# EAGLE design MainBoard (EAGLE 7.5.0)
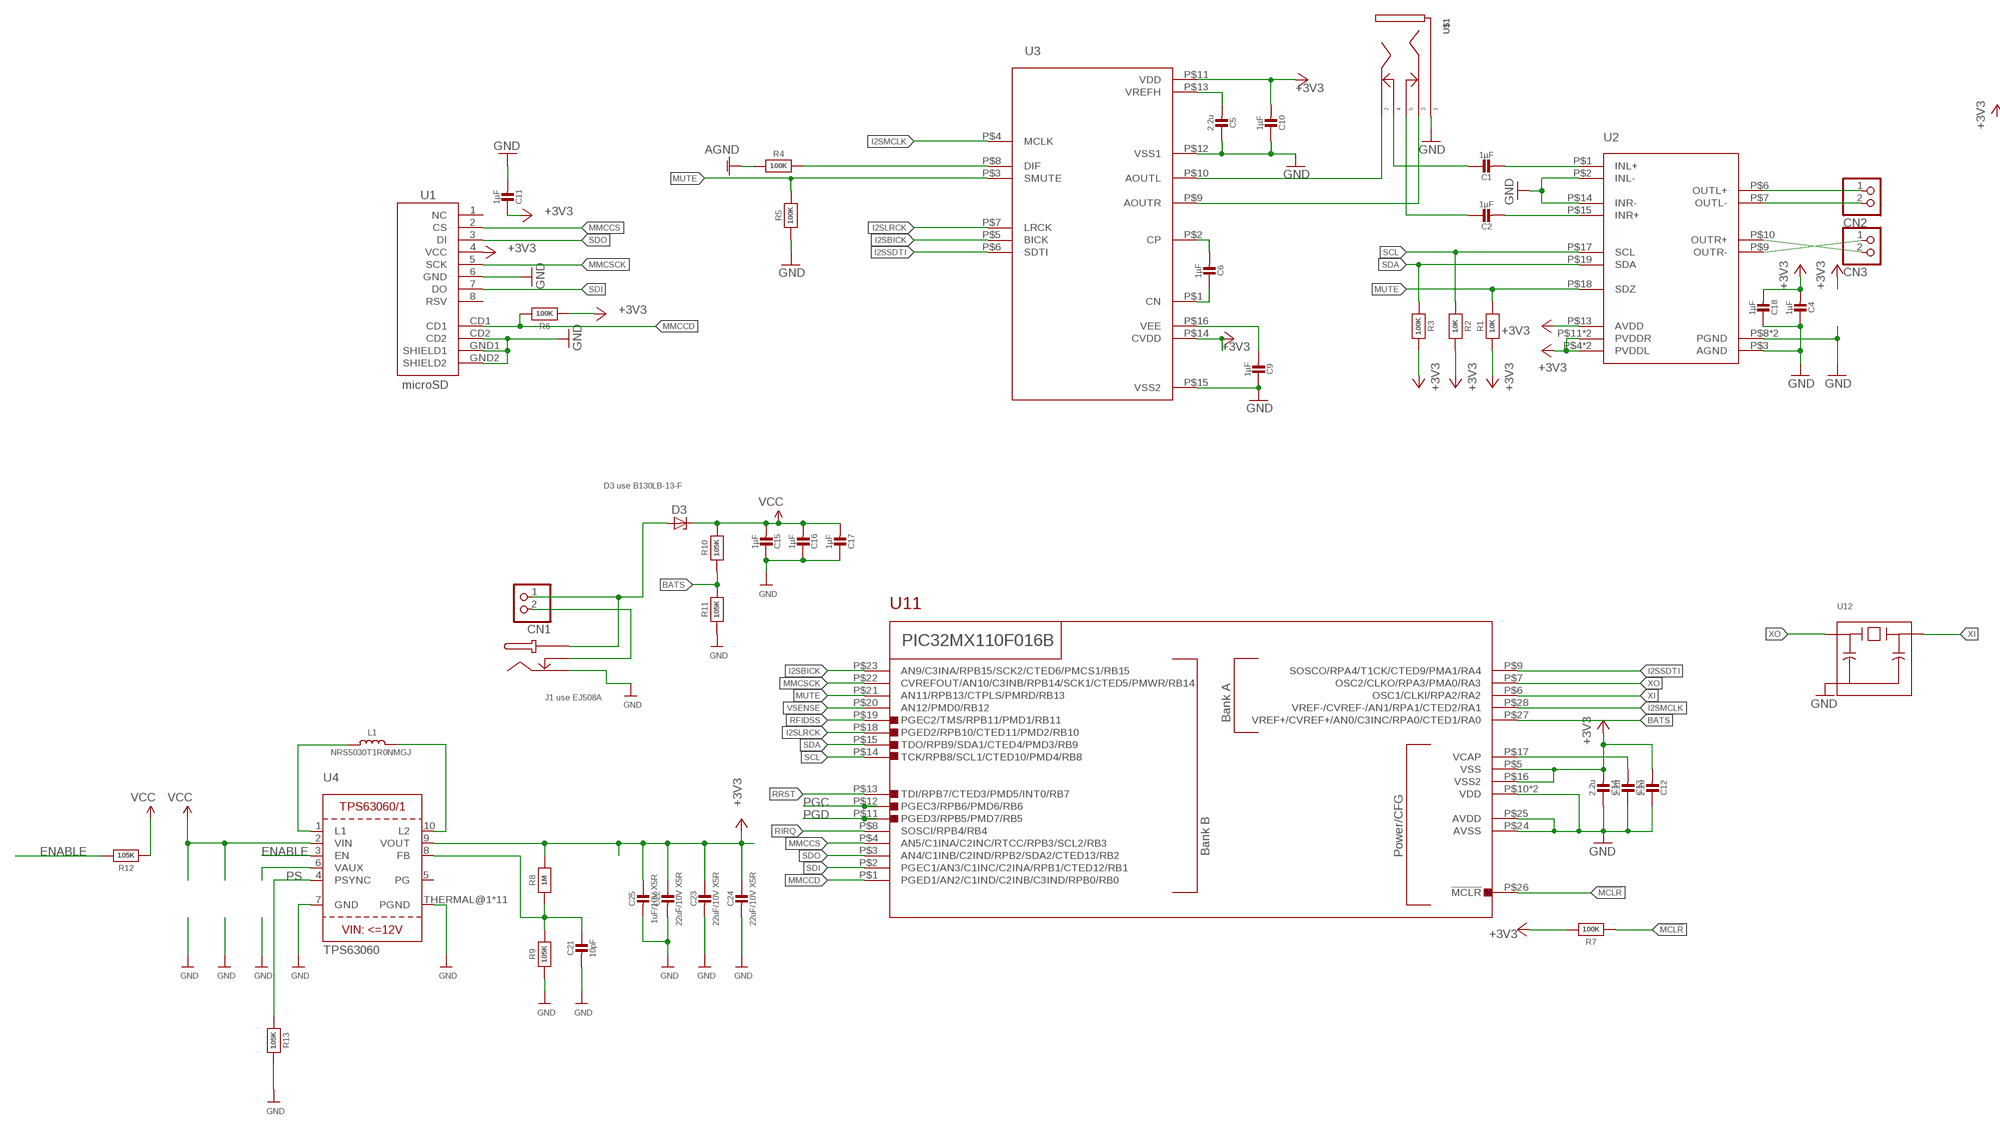
[diagram p0: schematic, sheet 1, part 1 of 2]
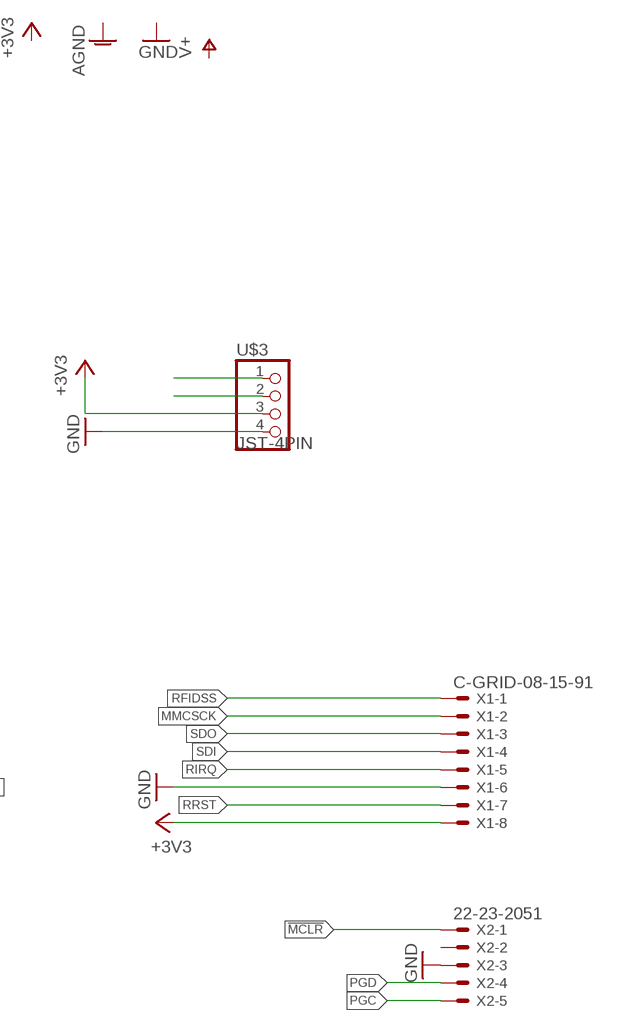
[diagram p1: schematic, sheet 1, part 2 of 2]

## Parts
C1  1µF  CAP_CERAMIC0603_NO  [0603-NO]
C2  1µF  CAP_CERAMIC0603_NO  [0603-NO]
C4  1µF  CAP_CERAMIC0805-NOOUTLINE  [0805-NO]
C5  2.2u  CAP_CERAMIC0603_NO  [0603-NO]
C6  1µF  CAP_CERAMIC0603_NO  [0603-NO]
C9  1µF  CAP_CERAMIC0603_NO  [0603-NO]
C10  1µF  CAP_CERAMIC0603_NO  [0603-NO]
C11  1µF  CAP_CERAMIC0603_NO  [0603-NO]
C12  2.2u  CAP_CERAMIC0603_NO  [0603-NO]
C13  2.2u  CAP_CERAMIC0603_NO  [0603-NO]
C14  2.2u  CAP_CERAMIC0603_NO  [0603-NO]
C15  1µF  CAP_CERAMIC0805-NOOUTLINE  [0805-NO]
C16  1µF  CAP_CERAMIC0805-NOOUTLINE  [0805-NO]
C17  1µF  CAP_CERAMIC0805-NOOUTLINE  [0805-NO]
C18  1µF  CAP_CERAMIC0805-NOOUTLINE  [0805-NO]
C21  10pF  CAP_CERAMIC0603_NO  [0603-NO]
C22  22uF/10V X5R  CAP_CERAMIC0805-NOOUTLINE  [0805-NO]
C23  22uF/10V X5R  CAP_CERAMIC0805-NOOUTLINE  [0805-NO]
C24  22uF/10V X5R  CAP_CERAMIC0805-NOOUTLINE  [0805-NO]
C25  1uF/10V X5R  CAP_CERAMIC0805-NOOUTLINE  [0805-NO]
CN1  JST_2PIN-SMT-RA  [JST-PH-2-SMT-RA]
CN2  JST_2PIN-SMT-RA  [JST-PH-2-SMT-RA]
CN3  JST_2PIN-SMT-RA  [JST-PH-2-SMT-RA]
D3  ZENER-DIODESOD80C  [SOD80C]
L1  NRS5030T1R0NMGJ  INDUCTORTDK_VLC5045  [INDUCTOR_5X5MM_TDK_VLC5045]
R1  10K  RESISTOR_0603_NOOUT  [0603-NO]
R2  10K  RESISTOR_0603_NOOUT  [0603-NO]
R3  100K  RESISTOR_0603_NOOUT  [0603-NO]
R4  100K  RESISTOR_0603_NOOUT  [0603-NO]
R5  100K  RESISTOR_0603_NOOUT  [0603-NO]
R6  100K  RESISTOR_0603_NOOUT  [0603-NO]
R7  100K  RESISTOR_0603_NOOUT  [0603-NO]
R8  1M  RESISTOR_0603_NOOUT  [0603-NO]
R9  105K  RESISTOR_0603_NOOUT  [0603-NO]
R10  105K  RESISTOR_0603_NOOUT  [0603-NO]
R11  105K  RESISTOR_0603_NOOUT  [0603-NO]
R12  105K  RESISTOR_0603_NOOUT  [0603-NO]
R13  105K  RESISTOR_0603_NOOUT  [0603-NO]
U1  microSD  USD-SOCKETSMD  [MICRO-SD-SOCKET-PP]
U2  TPA2016  [S-PWQFN-N20]
U3  AK4430ET  [16TSSOP]
U4  TPS63060  VREG_TPS63060/1  [PWSON-N10]
U11  PIC32MX110QFN  [28-QFN]
U12  CSTCE  [CSTCE]
U$1  3,5MMPHONO  [SJ1-351X]
U$2  PJ-002AH  [PJ-002AH-SMT]
U$3  JST-4PIN  [JST-PH-4-SMT-RA]
X1  C-GRID-08-15-91  [15-91-08]
X2  22-23-2051  [22-23-2051]

## Nets
!MCLR: R7.1 U11.P$26(!MCLR) X2.1
+3V3: C4.2 C10.2 C11.1 C12.2 C14.2 C18.2 C22.1 C23.1 C24.1 C25.1 R1.1 R2.2 R3.2 R6.1 R7.2 R8.2 U1.4(VCC) U2.P$4(PVDDL) U2.P$5(PVDDL) U2.P$11(PVDDR) U2.P$12(PVDDR) U2.P$13(AVDD) U3.P$11(VDD) U3.P$14(CVDD) U4.9(VOUT) U11.P$5(VSS) U11.P$16(VSS2) U$3.3 X1.8
AGND: R4.1
AOUTL: U3.P$10(AOUTL) U$1.2
AOUTR: U3.P$9(AOUTR) U$1.3
BATS: R10.1 R11.2 U11.P$27(VREF+/CVREF+/AN0/C3INC/RPA0/CTED1/RA0)
ENABLE: R12.2 U4.3(EN)
GND: C4.1 C5.1 C9.1 C10.1 C11.2 C12.1 C13.1 C14.1 C15.1 C16.1 C17.1 C18.1 C21.2 C22.2 C23.2 C24.2 C25.2 R5.1 R9.1 R11.1 R13.2 U1.6(GND) U1.CD2 U1.GND1(SHIELD1) U1.GND2(SHIELD2) U2.P$2(INL-) U2.P$3(AGND) U2.P$8(PGND) U2.P$14(INR-) U2.P$21(PGND) U3.P$12(VSS1) U3.P$15(VSS2) U4.7(GND) U4.THERMAL@1(PGND) U4.THERMAL@5(PGND) U4.THERMAL@6(PGND) U4.THERMAL@7(PGND) U4.THERMAL@8(PGND) U4.THERMAL@9(PGND) U4.THERMAL@10(PGND) U4.THERMAL@11(PGND) U4.THERMAL@12(PGND) U4.THERMAL@13(PGND) U4.THERMAL@14(PGND) U11.P$10(VDD) U11.P$24(AVSS) U11.P$25(AVDD) U11.P$29(VDD) U12.2 U$1.1 U$2.2 U$3.4 X1.6 X2.3
I2SBICK: U3.P$5(BICK) U11.P$23(AN9/C3INA/RPB15/SCK2/CTED6/PMCS1/RB15)
I2SLRCK: U3.P$7(LRCK) U11.P$18(PGED2/RPB10/CTED11/PMD2/RB10)
I2SMCLK: U3.P$4(MCLK) U11.P$28(VREF-/CVREF-/AN1/RPA1/CTED2/RA1)
I2SSDTI: U3.P$6(SDTI) U11.P$9(SOSCO/RPA4/T1CK/CTED9/PMA1/RA4)
MMCCD: R6.2 U1.CD1 U11.P$1(PGED1/AN2/C1IND/C2INB/C3IND/RPB0/RB0)
MMCCS: U1.2(CS) U11.P$4(AN5/C1INA/C2INC/RTCC/RPB3/SCL2/RB3)
MMCSCK: U1.5(SCK) U11.P$22(CVREFOUT/AN10/C3INB/RPB14/SCK1/CTED5/PMWR/RB14) X1.2
MUTE: R1.2 R5.2 U2.P$18(SDZ) U3.P$3(SMUTE) U11.P$21(AN11/RPB13/CTPLS/PMRD/RB13)
N$1: CN2.1 U2.P$6(OUTL+)
N$2: CN2.2 U2.P$7(OUTL-)
N$3: CN3.1 U2.P$9(OUTR-)
N$4: C2.1 U$1.5
N$5: C1.1 U$1.4
N$6: C1.2 U2.P$1(INL+)
N$7: C2.2 U2.P$15(INR+)
N$8: CN3.2 U2.P$10(OUTR+)
N$9: C5.2 U3.P$13(VREFH)
N$10: L1.P$1 U4.1(L1)
N$11: C13.2 U11.P$17(VCAP)
N$12: C9.2 U3.P$16(VEE)
N$13: C6.1 U3.P$1(CN)
N$14: C6.2 U3.P$2(CP)
N$15: R4.2 U3.P$8(DIF)
N$30: L1.P$2 U4.10(L2)
N$31: CN1.2 U$2.3
N$32: U4.6(VAUX)
N$33: C21.1 R8.1 R9.2 U4.8(FB)
N$36: CN1.1 D3.A U$2.1 U$2.A
PGC: U11.P$12(PGEC3/RPB6/PMD6/RB6) X2.5
PGD: U11.P$11(PGED3/RPB5/PMD7/RB5) X2.4
PS: R13.1 U4.4(PSYNC)
RFIDSS: U11.P$19(PGEC2/TMS/RPB11/PMD1/RB11) X1.1
RIRQ: U11.P$8(SOSCI/RPB4/RB4) X1.5
RRST: U11.P$13(TDI/RPB7/CTED3/PMD5/INT0/RB7) X1.7
SCL: R2.1 U2.P$17(SCL) U11.P$14(TCK/RPB8/SCL1/CTED10/PMD4/RB8) U$3.2
SDA: R3.1 U2.P$19(SDA) U11.P$15(TDO/RPB9/SDA1/CTED4/PMD3/RB9) U$3.1
SDI: U1.7(DO) U11.P$2(PGEC1/AN3/C1INC/C2INA/RPB1/CTED12/RB1) X1.4
SDO: U1.3(DI) U11.P$3(AN4/C1INB/C2IND/RPB2/SDA2/CTED13/RB2) X1.3
VCC: C15.2 C16.2 C17.2 D3.C R10.2 R12.1 U4.2(VIN)
VSENSE: U11.P$20(AN12/PMD0/RB12)
XI: U11.P$6(OSC1/CLKI/RPA2/RA2) U12.3
XO: U11.P$7(OSC2/CLKO/RPA3/PMA0/RA3) U12.1
Unconnected: U1.1(NC) U1.8(RSV) U4.5(PG) X2.2

## Notes on the sheet
- D3 use B130LB-13-F
- J1 use EJ508A

## Library data of the parts
C1 C2 C4-C6 C9-C18 C21-C25 = microbuilder:CAP_CERAMIC: Ceramic Capacitors For new designs, use the packages preceded by an '_' character since they are more reliable: The following footprints should be used on most boards: _0402 - Standard footprint for regular board layouts _0603 - Standard footprint for regular board layouts _0805 - Standard footprint for regular board layouts _1206 - Standard footprint for regular board layouts For extremely tight-pitch boards where space is at a premium, the following 'micro-pitch' footprints can be used (smaller pads, no silkscreen outline, etc.): _0402MP - Micro-pitch footprint for very dense/compact boards _0603MP - Micro-pitch footprint for very dense/compact boards _0805MP - Micro-pitch footprint for very dense/compact boards _1206MP - Micro-pitch footprint for very dense/compact boards
CN1-CN3 = adafruit:JST_2PIN: JST 2-Pin Connectors of various flavors SMT-RA (S2B-PH-SM4) 4UConnector #17311 SMT (B2B-PH-SM4) THM-RA (S2B-PH) THM (B2B-PH)
D3 = diode:ZENER-DIODE: Z-Diode
L1 = microbuilder:INDUCTOR: Inductors 0603: 10nH Ceramic Inductor - microwire antenna/RF (Digikey: 712-1434-2-ND) 0805: 560nH Ceramic Inductor - RF (Digikey: 553-1047-1-ND) 270nH Ceramic Inductor - Q = 40@250MHz, +-5%, 1 Ohm DC Resistance (Digikey: 535-10506-2-ND) 1007 (2518 Metric) SMT: 10µH 10% 250mOhm 820mA 1007 Inductor (Digikey: 587-2189-1-ND) 22µH 10% 500mOhm 580mA 1007 Inductor (Digikey: 587-2190-1-ND) 47µH 10% 950mOhm 420mA 1007 Inductor (Digikey: 587-2191-1-ND) 47µH 5% 100mOhm 1A 1008 Inductor (Digikey: 732-1816-1-ND) 5.0x5.0mm (Taiyo Yuden NR5040 Series) 6.8µH 20% 2.3A 64mOhm Inductor (Digikey: 587-2374-2-ND) 5.0x5.0mm (TDK VLC5045 Series) 4.7µH 20% 3.3A 34mOhm Inductor (Digikey: 445-6526-1-ND) 6.8µH 20% 2.7A 46mOhm Inductor (Digikey: 445-6527-1-ND) 6.0x6.0mm (TDK VLC6045 Series) 4.7µH 20% 3.8A 27mOhm Inductor (Digikey: 445-6538-2-ND) 6.8µH 20% 3A 41mOhm Inductor (Digikey: 445-6540-1-ND) 6.2µH 30% 2.2A 45mOhm Inductor (Digikey: SRR5028-6R2YCT-ND) - Not TDK VLC6045 but footprint should match 6.0x6.0mm (TDK SLF6045 Series) 6.8uH 30% 2A 33mOhm Inductor (Digikey: 445-4572-1-ND, Mouser: 810-SLF645T6R8N2R0PF) 6.0x6.0mm (Sumida CDRH5D28 Series) 6.2uH 30% 1.8A 45mOhm Inductor (Digikey: 308-1542-1-ND) Taiyo Yuden NR3015T2R2M - 2.2uH 20% 1.5A (Digikey: 587-1648-2-ND, Mouser: 963-NR3015T2R2M) - Used with TI TPS62172 CoilCraft RFID Transponder Coil - MA5532-AE (For use with AS3935 Lightning Sensor) Vishay IHLP 1.0uH Molded Inductor - 24mOhm DCR, 5A, +/-20%, -55°C-125°C (Digikey: 541-1319-1-ND)
R1-R13 = microbuilder:RESISTOR: Resistors For new designs, use the packages preceded by an '_' character since they are more reliable: The following footprints should be used on most boards: _0402 - Standard footprint for regular board layouts _0603 - Standard footprint for regular board layouts _0805 - Standard footprint for regular board layouts _1206 - Standard footprint for regular board layouts For extremely tight-pitch boards where space is at a premium, the following 'micro-pitch' footprints can be used (smaller pads, no silkscreen outline, etc.): _0402MP - Micro-pitch footprint for very dense/compact boards _0603MP - Micro-pitch footprint for very dense/compact boards _0805MP - Micro-pitch footprint for very dense/compact boards _1206MP - Micro-pitch footprint for very dense/compact boards
U1 = SparkFun:USD-SOCKET: microSD Socket Push-push type uSD socket. Schematic element and footprint production proven. Spark Fun Electronics SKU : PRT-00127. tDoc lines correctly indicate media card edge positions when inserting (unlocked, locked, depressed).
U2 = tpa2016:TPA2016
U3 = AK4430ET:AK4430ET
U4 = microbuilder:VREG_TPS63060/1: TPS63060/63061 2A Boost/Buck Switch Converter VIN: 2.5 - 12V Fixed frequency operation: 2.4MHz
U11 = pic32mx110:PIC32MX110
U12 = CSTCE:CSTCE
U$1 = sj1-351x:3,5MMPHONO
U$2 = PJ-002AH-SMT:PJ-002AH
U$3 = adafruit:JST-4PIN
X1 = con-molex:C-GRID-08: CONNECTOR wire to board 2.54 mm (0.100") pitch header; OC_FARNELL: unknown; OC_NEWARK: unknown
X2 = con-molex:22-23-2051: .100" (2.54mm) Center Header - 5 Pin; MF: MOLEX; MPN: 22-23-2051; OC_FARNELL: 1462952; OC_NEWARK: 38C9178

## Board
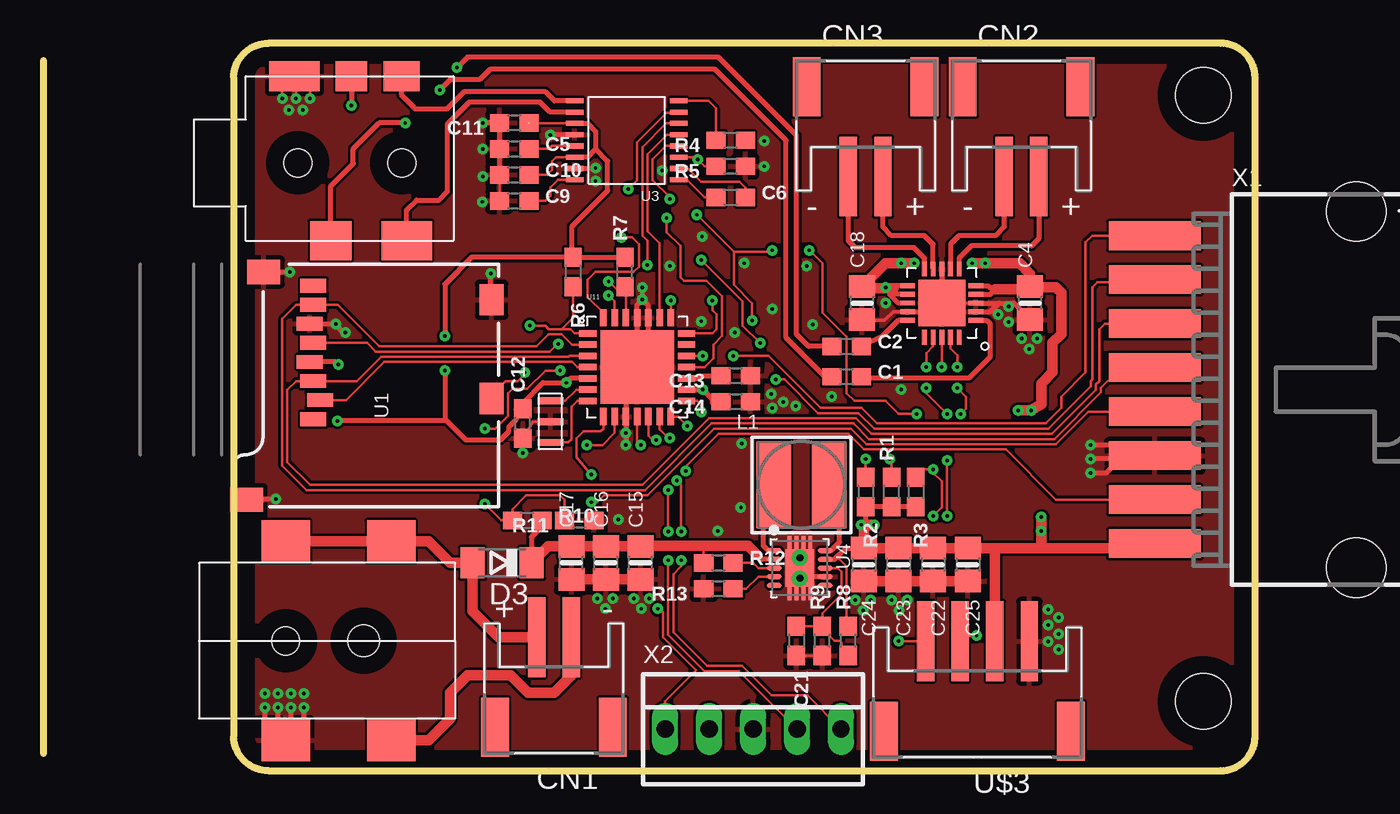
[diagram p2: board, top side]
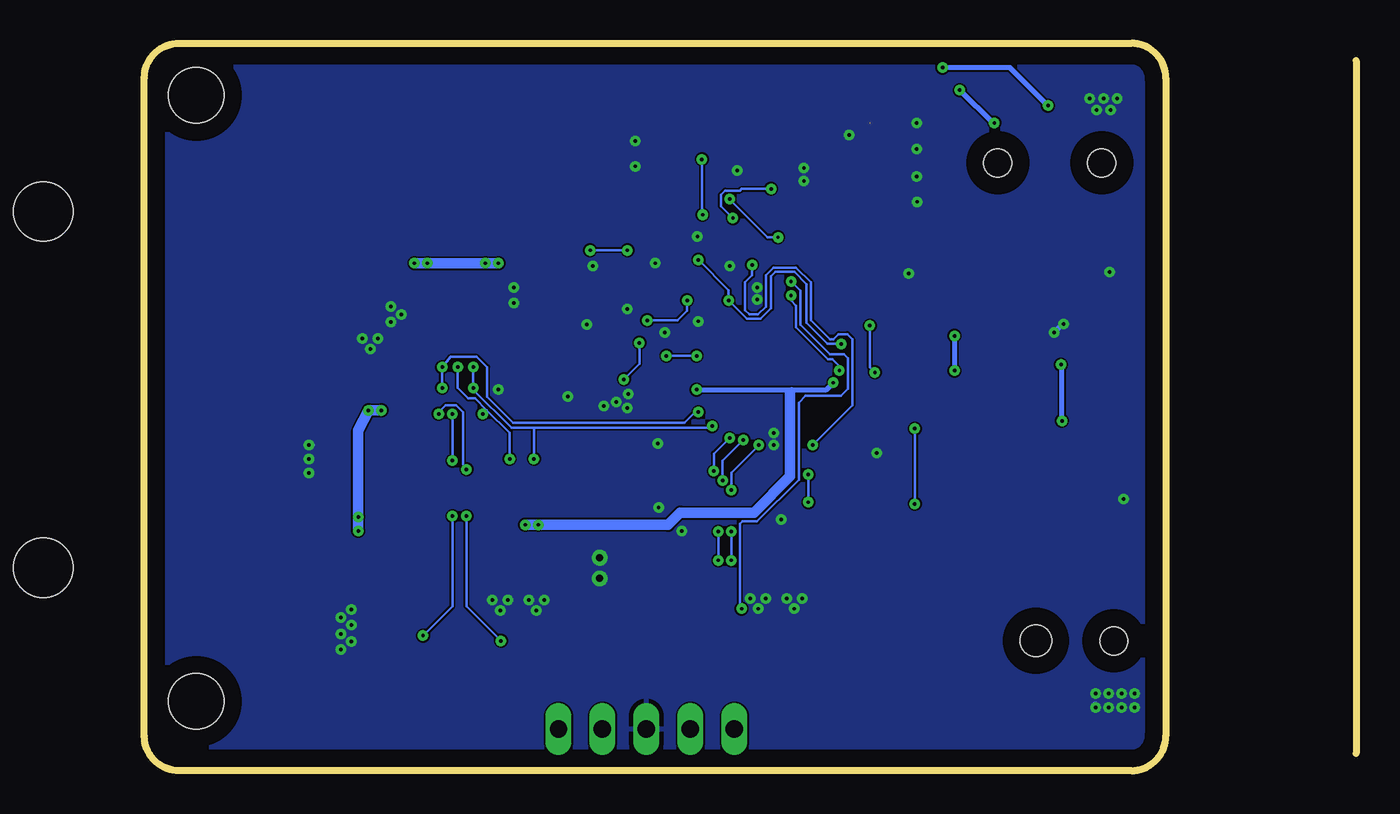
[diagram p3: board, bottom side, seen from below]

Size 70 x 42 mm. Coordinates in mm from the lower left corner, seen from the top.
Outline: 0,41 0,1
Outline: 11,40 11,2 arc90 13,0 68,0 arc90 70,2 70,40 arc90 68,42 13,42 arc90 11,40
Copper layers (1*16): Top 0.035mm / dielectric 1.5mm / Bottom 0.035mm
Design rules "default *": minimum track width 10mil, minimum drill 24mil, track to track 4mil, track to pad 4mil, pad to pad 4mil, via to via 4mil, smd to smd 4mil, copper to edge 40mil, drill to drill 2mil, minimum pad ring 10mil, minimum via ring 8mil, stop-mask expansion 4mil, vias tented up to drill 0mil, thermal gap 10mil
Holes 3.2 mm at 67,4 67,39

### Footprints (pad centres in the part's own frame; a part is rotated, then mirrored left to right if it is on the bottom)
0603-NO = smd 1.1 x 1: 1 -0.85,0; 2 0.85,0
0805-NO = smd 1.3 x 1.5: 1 -0.95,0; 2 0.95,0
JST-PH-2-SMT-RA = smd 1 x 4.6: 1 1,-3.7; 2 -1,-3.7 | smd 1.6 x 3.4: NC1 -3.4,1.5; NC2 3.4,1.5
SOD80C = smd 1.4 x 1.8: A 1.7,0; C -1.7,0
INDUCTOR_5X5MM_TDK_VLC5045 = smd 2 x 5: P$1 -1.6,0; P$2 1.6,0
MICRO-SD-SOCKET-PP = smd 0.8 x 1.5: 1 -8.94,10.7; 2 -7.84,10.3; 3 -6.74,10.7; 4 -5.64,10.9; 5 -4.54,10.7; 6 -3.44,10.9; 7 -2.34,10.7; 8 -1.24,10.7 | smd 1.8 x 1.4: CD1 -7.75,0.4; CD2 -2.05,0.4 | smd 1.4 x 1.9: GND1 -13.6,14.55; GND2 -0.45,13.55
S-PWQFN-N20 = smd 0.28 x 0.85: P$1 1,1.975; P$2 0.5,1.975; P$3 0,1.975; P$4 -0.5,1.975; P$5 -1,1.975; P$11 -1,-1.975; P$12 -0.5,-1.975; P$13 0,-1.975; P$14 0.5,-1.975; P$15 1,-1.975 | smd 0.85 x 0.28: P$6 -1.975,1; P$7 -1.975,0.5; P$8 -1.975,0; P$9 -1.975,-0.5; P$10 -1.975,-1; P$16 1.975,-1; P$17 1.975,-0.5; P$18 1.975,0; P$19 1.975,0.5; P$20 1.975,1 | smd 2.7 x 2.7: P$21 0,0
16TSSOP = smd 0.3 x 1: P$1 -2.275,-3; P$2 -1.625,-3; P$3 -0.975,-3; P$4 -0.325,-3; P$5 0.325,-3; P$6 0.975,-3; P$7 1.625,-3; P$8 2.275,-3; P$9 2.275,3; P$10 1.625,3; P$11 0.975,3; P$12 0.325,3; P$13 -0.325,3; P$14 -0.975,3; P$15 -1.625,3; P$16 -2.275,3
PWSON-N10 = smd 0.28 x 0.85: 1 -1,-1.475; 2 -0.5,-1.475; 3 0,-1.475; 4 0.5,-1.475; 5 1,-1.475; 6 1,1.475; 7 0.5,1.475; 8 0,1.475; 9 -0.5,1.475; 10 -1,1.475 | smd 2.15 x 1.66: THERMAL@1 0,0 | drill 0.4 pad 0.6: THERMAL@5 -0.6,0; THERMAL@6 0.6,0 | smd 0.8 x 0.23: THERMAL@7 1.46,0.6; THERMAL@8 1.46,0.2; THERMAL@9 1.46,-0.2; THERMAL@10 1.46,-0.6; THERMAL@11 -1.46,-0.6; THERMAL@12 -1.46,-0.2; THERMAL@13 -1.46,0.2; THERMAL@14 -1.46,0.6
28-QFN = smd 1 x 0.37: P$1 -2.85,1.95; P$2 -2.85,1.3; P$3 -2.85,0.65; P$4 -2.85,0; P$5 -2.85,-0.65; P$6 -2.85,-1.3; P$7 -2.85,-1.95; P$15 2.85,-1.95; P$16 2.85,-1.3; P$17 2.85,-0.65; P$18 2.85,0; P$19 2.85,0.65; P$20 2.85,1.3; P$21 2.85,1.95 | smd 0.37 x 1: P$8 -1.95,-2.85; P$9 -1.3,-2.85; P$10 -0.65,-2.85; P$11 0,-2.85; P$12 0.65,-2.85; P$13 1.3,-2.85; P$14 1.95,-2.85; P$22 1.95,2.85; P$23 1.3,2.85; P$24 0.65,2.85; P$25 0,2.85; P$26 -0.65,2.85; P$27 -1.3,2.85; P$28 -1.95,2.85 | smd 4.25 x 4.25: P$29 0,0
CSTCE = smd 0.4 x 1.5: 1 1.2,0; 2 0,0; 3 -1.2,0
SJ1-351X = smd 2.9 x 1.75: 1 -0.2,5 | smd 2.9 x 2.25: 2 6.3,-4.5 | smd 2.1 x 1.75: 3 6,5 | smd 2.4 x 2.25: 4 1.9,-4.5 | smd 1.8 x 1.75: 5 3.1,5 | hole 1.6: 0,0; 6,0
PJ-002AH-SMT = smd 2.8 x 2.4: 1 5,5.75; 2 5,-5.75; 3 11.1,-5.75; A 11.1,5.75 | hole 1.6: 5,0 | hole 1.8: 9.5,0
JST-PH-4-SMT-RA = smd 1 x 4.6: 1 3.04,-2.47; 2 1.04,-2.47; 3 -0.96,-2.47; 4 -2.96,-2.47 | smd 1.6 x 3.4: NC1 -5.36,2.73; NC4 5.44,2.73
15-91-08 = smd 1.651 x 5.334: 1 -8.89,-10.795; 2 -6.35,-10.795; 3 -3.81,-10.795; 4 -1.27,-10.795; 5 1.27,-10.795; 6 3.81,-10.795; 7 6.35,-10.795; 8 8.89,-10.795 | hole 3.404: -10.287,0.838; 10.287,0.838
22-23-2051 = drill 1 long: 1 -5.08,0; 2 -2.54,0; 3 0,0; 4 2.54,0; 5 5.08,0

### Placement (x,y rotation side)
C1  46.4,22.75 0 top
C2  46.4,24.5 0 top
C4  57,27 90 top
C5  27.2,35.9 0 top
C6  39.7,33.1 0 top
C9  27.2,32.9 0 top
C10  27.2,34.4 0 top
C11  27.2,37.4 180 top
C12  27.7,20.05 90 top
C13  40,22.8 180 top
C14  40,21.3 180 top
C15  34.5,12 90 top
C16  32.5,12 90 top
C17  30.5,12 90 top
C18  47.3,27 90 top
C21  43.5,7.5 270 top
C22  51.4,11.9 270 top
C23  49.4,11.9 270 top
C24  47.4,11.9 270 top
C25  53.4,11.9 270 top
CN1  29.5,4 180 top
CN2  56.5,38 0 top
CN3  47.5,38 0 top
D3  26.5,12 180 top
L1  43.8,16.5 0 top
R1  49,16.1 90 top
R2  47.5,16.1 270 top
R3  50.4,16.1 270 top
R4  39.7,36.4 180 top
R5  39.7,34.9 180 top
R6  30.6,28.8 270 top
R7  33.6,28.8 90 top
R8  46.5,7.5 90 top
R9  45,7.5 90 top
R10  27.95,14.45 0 top
R11  30.95,14.45 180 top
R12  39,12 0 top
R13  39,10.5 180 top
U1  26.29,29.24 90 top
U2  51.9,27 270 top
U3  33.7,36.4 90 top
U4  43.7,11.7 270 top
U11  34.3,23.3 0 top
U12  29.3,20.15 270 top
U$1  14.7,35.1 0 top
U$2  9,7.5 0 top
U$3  54,5 180 top
X1  75,22 270 top
X2  41,2.4 0 top

### Tracks (layer width: path | path; a pad name or v marks a point on that pad's centre or on a via)
!MCLR  (via drill 0.2 pad 0.13)
  Top 0.15: 33.65,27.9 U11.P$26 | X2.1 35.92,4.02 37.7,5.8 35.8,7.7 35.8,9.15 35.6,9.35 v35.5,9.35 | R7.1 33.6,27.6 33.3,27.6 v32.65,28.25
  Top 0.3: R7.1 33.65,27.9
  Bottom 0.15: v35.5,9.35 35.6,9.45 35.6,14.25 35.45,14.4 34.6,14.4 32.2,16.8 32.2,21.25 31.8,21.65 29.75,21.65 29.35,22.05 29.35,23.8 29.6,24.05 30.4,24.05 32.1,25.75 32.1,27.7 v32.65,28.25
+3V3  (via drill 0.2 pad 0.13)  (1 unrouted)
  Top 0.15: U3.P$11 28.05,37.38 | U3.P$14 29.62,35.42 29.4,35.2 29.4,34.7 29.1,34.4 C10.2 | R8.2 46.4,8.45 46.4,11.8 46,12.2 46,12.5
  Top 0.2: 55,27.8 55.15,27.95 | 49.1,27.8 49.1,27.85
  Top 0.3: U3.P$11 31.43,37.38 31.9,36.9 31.9,35.9 | 31.9,35.9 31.43,35.42 U3.P$14 | C14.2 38.8,21.3 v38.1,22 U11.P$16 | U4.9 45.7,12.2 46,12.5 46.35,12.85 C24.1 | 31.9,35.9 32.6,35.2 32.6,33.5 30.55,31.45 30.55,29.7 R6.1 | 23.3,20.2 v16.99,20.2 | R6.1 24.75,29.65 23.2,28.1 v23.2,25.1 | v23.2,23.1 23.2,20.3 23.3,20.2 | U2.P$13 49.4,27 48.9,27.5 | U2.P$11 48.75,28 arc90 48.6,27.85 | U2.P$12 48.9,27.5 | 48.9,27.5 48.9,27.85 | U2.P$4 54.7,27.5 54.9,27.7 | 54.9,27.7 55,27.8 | U2.P$5 54.6,28 54.9,27.7 | R3.2 R1.1 R2.2 47.5,14.45 v47.25,14.2 | v17.05,23.45 16.9,23.6 U1.4 | R6.1 R7.2 | U11.P$5 30.45,22.65 v30.2,22.4 28.85,22.4 27.7,21.25 C12.2 27.3,20.85 27.3,20.25 26.9,19.85 26.9,19.6 26.4,19.1 24.4,19.1 23.3,20.2
  Top 0.6: 55.1,12.85 C25.1 C22.1 C23.1 C24.1 47.4,14.1 v48,14.2 v47.25,14.2 | 55.1,12.85 57.7,12.85 | 57.7,12.85 63.95,12.85 X1.8 | U$3.3 54.96,12.71 55.1,12.85 | 57.7,12.85 57.65,12.9 v57.65,13.85 v57.65,14.65 | C4.2 57.05,27.9 58.5,27.9 58.8,27.6 58.8,25.2 58.3,24.7 58.3,23 57.65,22.35 57.65,21.15 v57.05,20.8 v56.3,20.8 | C4.2 57,28.7 56.4,29.3 v54.4,29.3 v53.65,29.3 | v50.3,29.3 v49.55,29.3 48.65,29.3 C18.2 47.4,27.85 48.6,27.85 48.9,27.85 49.1,27.85 | 38.8,21.3 38.85,21.35 39.1,21.35 | 55,27.8 56.85,27.8 C4.2
  Bottom 0.3: v38.1,22 32.6,22 | 32.6,22 30.6,22 v30.2,22.4 | v23.2,25.1 v23.2,23.1 | 32.7,21.8 32.6,21.9 32.6,22 | v16.99,20.2 16.99,23.39 v17.05,23.45
  Bottom 0.6: v54.4,29.3 v49.55,29.3 | v48,14.2 39.75,14.2 39.05,14.9 34.8,14.9 32.7,17 32.7,21.8 | v57.65,13.85 57.65,19.65 v57.05,20.8 v56.3,20.8
AOUTL
  Top 0.3: U3.P$10 29.27,38.02 28.7,38.6 24.6,38.6 23.35,37.35 23.35,33.45 22.85,32.95 21.55,32.95 21,32.4 U$1.2
AOUTR
  Top 0.3: U3.P$9 29.52,38.67 29,39.2 24.3,39.2 23.3,38.2 21.5,38.2 20.7,39 U$1.3
BATS  (via drill 0.2 pad 0.13)
  Top 0.15: U11.P$27 33,27.1 v32.65,27.45 | v29.85,23.1 29,23.1 27.95,22.05 27.1,22.05 26.85,21.8 26.85,20.5 26.1,19.75 v25.5,19.75 | R11.2 30.1,15.65 29.85,15.9 27.9,15.9 27.1,15.1 R10.1 26.45,14.45 v25.5,15.4
  Bottom 0.15: v32.65,27.45 32.65,27.15 32.35,26.85 32.35,25.6 30.5,23.75 30.25,23.75 29.85,23.35 v29.85,23.1 | v25.5,19.75 v25.5,15.4
ENABLE
  Top 0.15: U4.3 41.3,11.7 41,12 R12.2
GND  (via drill 0.2 pad 0.13)
  Top 0.15: C21.2 R9.1 | v27.7,18.35 C12.1 28.3,20.15 U12.2 | C10.1 C9.1 | U$1.1 15.4,39.2 v15.4,38.8 | 14.6,39.2 v14.6,38.8 | 13.8,39.2 v13.8,38.8 | U2.P$3 U2.P$21
  Top 0.2: 47.05,26 48.6,26 49.1,26.5 U2.P$14
  Top 0.3: U2.P$8 U2.P$21 51.4,26.5 U2.P$14 | U11.P$29 33.65,22.65 U11.P$10 33.65,18.85 | U11.P$29 34.3,23.4 34,23.7 34,23.9 33.7,24.2 34.3,24.8 U11.P$25 34.3,26.9 v34.6,27.2 | U11.P$29 35,24 35,24.6 34.95,24.65 U11.P$24 34.95,26.85 v34.6,27.2 | U4.7 43.7,11.2 U4.THERMAL@1 | U3.P$12 29.32,36.73 v29.3,36.7 | C10.1 C5.1 C11.2 v25.4,37.4 | U3.P$15 31.88,34.77 v31.9,34.8 | v34.6,27.2 v34.6,27.9 | U1.6 v16.9,25.8 | v17.45,25.3 17.35,25.3 16.9,25.75 | U$2.2 14,2.35 | 14,2.35 14,2.6 | v15.05,3.65 15.05,2.5 15,2.45 14.1,2.45 14,2.35 | v14.3,3.65 14.3,2.5 | v13.55,3.65 13.55,2.5 | v12.8,3.65 12.8,2.5 | U1.CD2 25.85,27.23 v25.85,28.7 | U1.GND2 v14.25,28.8 | U1.GND1 11.8,15.7 v13.45,15.7 | X1.6 63.59,18.8 v60.5,18.8 | 63.59,18 v60.5,18 | v60.5,17.2 61.4,17.2 61.8,17.6 63.2,17.6 63.7,18.1 | U2.P$3 55.2,27 | 55.2,27 56.05,27 C4.1 | U2.P$2 54.7,26.5 55.2,27
  Top 0.6: C25.2 C22.2 C23.2 C24.2 | C17.1 C16.1 C15.1
  Bottom 0.15: v34.6,27.2 34.6,27.3 | v15.4,38.8 15.4,38.7
  Bottom 0.3: v29.3,36.7 29.3,36.6 | v31.9,34.8 32,34.8 | v16.9,25.8 16.95,25.8 v17.45,25.3 | v15.05,3.65 15.05,3.8 15.1,3.85 | v25.4,37.4 25.3,37.4 | v60.5,18.8 60.3,18.8
  other vias: 33.65,19.5 33.65,18.8 25.4,35.9 25.4,34.3 35,9.95 34.1,9.95 34.55,9.35 32.9,9.95 32,9.95 32.45,9.35 47.8,9.85 46.9,9.85 47.35,9.25 49,9.85 49.9,9.85 49.45,9.25 58.05,9.3 58.65,8.85 58.05,8.4 58.65,7.9 58.05,7.45 58.65,7 57.4,24.95 56.95,24.35 56.5,24.95 55.75,26.8 55.15,26.35 55.75,25.9 48.65,27.9 48.65,27 41.65,34.9 41.65,36.35 31.9,34.05 15,38.15 14.2,38.15 12.8,4.45 13.55,4.45 14.3,4.45 15.05,4.45 42.1,26.65 38.05,30.85 35.75,34.65 49.55,22 39.95,25.3 38,25.95 36.2,29.15 42.1,20.95 42.05,21.75 42.75,21.3 43.45,21.05 40.35,18.9 40.3,15.2 38.95,13.85 25.35,32.85 45.55,21.6 40.5,29.3 44.1,29.15 44.45,25.75 33.2,14.5
  pour Bottom: 8.8,46.6 73.1,46.6 73.1,-2.2 7.7,-2.2 7.7,40.3
  pour Top (isolate 0.15): 5.8,49.05 71.15,49.05 71.15,-6 6.9,-6 6.9,45.1
I2SBICK
  Top 0.15: U3.P$5 36.02,36.73 34.9,35.6 34.9,31.15 35.6,30.45 U11.P$23
I2SLRCK  (via drill 0.2 pad 0.13)
  Top 0.15: U3.P$7 36.67,38 36,38 34.3,36.3 34.3,34.1 v33.8,33.6 | U11.P$18 38.2,23.3 38.7,23.8 38.7,24.6 39.2,25.1 39.2,27.4 38.3,28.3 37,28.3 36.8,28.5 36.8,30.3 36,31.1 v36,31.9
  Bottom 0.15: v36,31.9 36.7,32.6 36.7,33.25 36.45,33.5 35.6,33.5 35.5,33.6 v33.8,33.6
I2SMCLK  (via drill 0.2 pad 0.13)
  Top 0.15: U3.P$4 35.98,36.08 35.2,35.3 35.2,34.1 36.2,33.1 v36.2,33 | v33.4,30.8 34,30.8 34.4,30.4 34.4,29.1 34.1,28.8 31.9,28.8 31.45,28.35 31.45,27.35 32.35,26.45 U11.P$28
  Bottom 0.15: v33.4,30.8 34,30.8 v36.2,33
I2SSDTI  (via drill 0.2 pad 0.13)
  Top 0.15: v34.9,29.2 34.9,30.6 34.6,30.9 34.6,36 35.98,37.38 U3.P$6 | v31.4,18.8 32.3,18.8 33,19.5 U11.P$9
  Bottom 0.15: v31.4,18.8 29.1,21.1 29.1,24.9 29.4,25.2 29.9,25.2 30.2,24.9 30.4,24.9 31.5,26 31.5,28.2 32.35,29.05 33.65,29.05 34.1,28.6 34.1,26.8 34.55,26.35 35.05,26.35 35.3,26.6 35.3,28.2 34.9,28.6 v34.9,29.2
MMCCD  (via drill 0.2 pad 0.13)
  Top 0.15: U1.CD1 25.89,21.69 26.7,22.5 27.4,22.5 27.8,22.9 v27.8,23 | 29.95,25.5 29.2,25.5 29,25.7 v28.1,25.7 | 29.95,25.5 30.6,26.15 R6.2 | U11.P$1 30.7,25.25 30.45,25.5 29.95,25.5
  Bottom 0.15: v27.8,23 28.1,23.3 v28.1,25.7
MMCCS
  Top 0.15: U1.2 17.5,21.4 19.7,23.6 30.55,23.6 30.85,23.3 U11.P$4
MMCSCK  (via drill 0.2 pad 0.13)
  Top 0.15: U1.5 18.7,24.7 19.2,24.2 29.25,24.2 29.7,24.65 v29.75,24.65 | U11.P$22 v36.25,27.15 | X1.2 64.06,28.2 60.9,28.2 60.6,27.9 60.6,22.6 60.5,22.5 60.5,22.2 58.05,19.75 48,19.75 47.1,20.65 44.75,20.65 42.8,22.6 v42.3,22.6 | v41.4,24.7 40.4,25.7 40.4,27.1 v38,29.5
  Bottom 0.15: v42.3,22.6 41.4,23.5 v41.4,24.7 | v38,29.5 36.25,27.75 v36.25,27.15 35.2,26.1 34.4,26.1 33.8,26.7 33.8,28.55 33.55,28.8 32.45,28.8 31.75,28.1 31.75,25.85 30.55,24.65 v29.75,24.65
MUTE  (via drill 0.2 pad 0.13)
  Top 0.15: U3.P$3 37.67,35.42 v37.8,35.3 38.2,34.9 R5.2 | U2.P$18 v51.9,23.3 | v48.9,18 49,17.9 R1.2 | v37.75,32.1 39.9,29.95 | v44.25,30.05 45,29.3 45,26.45 46.4,25.05 46.4,21.8 46.85,21.35 48.65,21.35 49.4,20.6 v50.45,20.6 | 39.9,29.95 39.9,28.05 40.95,27 v40.95,26 | v38.65,27.15 38.65,26.6 38.9,26.35 38.9,25.5 38.65,25.25 U11.P$21 | 39.9,29.95 42,29.95 v42.1,30.05
  Bottom 0.15: v51.9,23.3 51.9,22.1 51.3,21.5 50.9,21.5 50.23,20.82 | 50.23,20.82 48.9,19.5 v48.9,18 | v37.8,35.3 37.8,32.15 v37.75,32.1 | v42.1,30.05 v44.25,30.05 | 50.23,20.82 50.23,20.77 50.27,20.77 v50.45,20.6 | v40.95,26 39.2,26 38.65,26.55 v38.65,27.15
N$1
  Top 0.3: CN2.1 57.5,30.7 57.1,30.3 53.6,30.3 52.9,29.6 U2.P$6
N$2
  Top 0.3: CN2.2 55.5,31.4 55,30.9 52.9,30.9 52.4,30.4 U2.P$7
N$3
  Top 0.3: U2.P$9 51.4,30.4 50.9,30.9 49,30.9 48.5,31.4 CN3.1
N$4  (via drill 0.2 pad 0.13)
  Top 0.3: U$1.5 v17.8,38.4 | v23.9,40.6 24.5,41.2 39,41.2 43.5,36.7 43.5,25.2 44.2,24.5 C2.1
  Bottom 0.3: v17.8,38.4 20,40.6 v23.9,40.6
N$5  (via drill 0.2 pad 0.13)
  Top 0.3: v22.9,39.3 23.5,39.9 25.2,39.9 25.8,40.5 38.8,40.5 42.9,36.4 42.9,25 45.15,22.75 C1.1 | v20.9,37.4 19.4,37.4 17.9,35.9 17.9,35.05 16.6,33.75 U$1.4
  Bottom 0.3: v22.9,39.3 21,37.4 v20.9,37.4
N$6
  Top 0.3: U2.P$1 54.5,26 54.7,25.8 54.7,23.9 53.5,22.7 47.3,22.7 C1.2
N$7
  Top 0.3: U2.P$15 49.4,26 48.5,25.1 C2.2
N$8
  Top 0.3: U2.P$10 50.9,29.6 50.3,30.2 46.9,30.2 46.5,30.6 CN3.2
N$9
  Top 0.15: U3.P$13 29.38,36.08 29.2,35.9 C5.2
N$10
  Top 0.3: U4.1 41.9,12.7 41.6,13 41.6,14.3 42.2,14.9 L1.P$1
N$11
  Top 0.3: U11.P$17 37.75,22.65 37.9,22.8 C13.2
N$12
  Top 0.15: U3.P$16 29.73,34.12 29.3,33.7 29.3,33.2 29,32.9 C9.2
N$13
  Top 0.15: C6.1 38.2,33.1 37.17,34.12 U3.P$1
N$14
  Top 0.15: C6.2 40.55,33.65 40.2,34 38,34 37.23,34.77 U3.P$2
N$15
  Top 0.15: U3.P$8 38.42,38.67 38.85,38.25 R4.2
N$30
  Top 0.3: U4.10 45.5,12.7 46,13.2 46,14.6 45.4,15.2 L1.P$2
N$31
  Top 0.6: CN1.2 30.5,5.5 29.5,4.5 28,4.5 27,5.5 24.5,5.5 23.5,4.5 23.5,3 22.25,1.75 U$2.3
N$33
  Top 0.15: U4.8 45.9,11.7 46.1,11.5 46.1,10.2 45,9.1 R9.2 | R8.1 46.1,7.05 46.1,7.4 46,7.5 45.7,7.5 45,8.2 R9.2 | C21.1 R9.2
N$36
  Top 0.6: CN1.1 26.3,7.7 24.8,9.2 D3.A 23.5,12 22.25,13.25 U$2.A U$2.1
PGC  (via drill 0.2 pad 0.13)
  Top 0.15: U11.P$12 34.95,19.35 35.2,19.1 v35.4,19.1 | v36.6,16.75 36.85,16.5 v36.85,13.8 | v36.85,12.15 36.85,11.8 36.4,11.35 36.4,8 38.35,6.05 40.35,6.05 42.05,4.35 44.13,4.35 X2.5
  Bottom 0.15: v35.4,19.1 36.6,17.9 v36.6,16.75 | v36.85,13.8 v36.85,12.15
PGD  (via drill 0.2 pad 0.13)
  Top 0.15: U11.P$11 34.3,19 v34.5,18.8 | v36.1,16.2 v36.1,13.8 | 36.1,12.2 v36.1,12.15 36.1,7.85 38.2,5.75 40.19,5.75 X2.4
  Bottom 0.15: v34.5,18.8 36.1,17.2 v36.1,16.2 | v36.1,13.8 v36.1,12.15
PS
  Top 0.15: R13.1 40.6,10.5 41.3,11.2 U4.4
RFIDSS  (via drill 0.2 pad 0.13)
  Top 0.15: X1.1 60.59,30.89 60.2,30.5 60.2,23 58.8,21.6 58.8,20.95 57.9,20.05 48.15,20.05 47.25,20.95 44.9,20.95 41.9,23.95 v39.85,23.95 | U11.P$19 v38.1,23.95
  Bottom 0.15: 37.9,23.95 v38.1,23.95 v39.85,23.95
RIRQ  (via drill 0.2 pad 0.13)
  Top 0.15: X1.5 60.38,20.73 58.5,18.85 47.55,18.85 46.65,19.75 38.75,19.75 34.9,15.9 32.4,15.9 32,15.5 v31.65,15.5 | v31.65,17.1 30.8,18.1 30.8,19.2 31.2,19.6 32.2,19.6 32.35,19.75 U11.P$8
  Bottom 0.15: v31.65,15.5 v31.65,17.1
RRST  (via drill 0.2 pad 0.13)
  Top 0.15: X1.7 58.5,15.65 55.6,18.55 47.4,18.55 46.5,19.45 39,19.45 37.1,17.55 v37.1,17.3 | v36.2,19.2 36.1,19.3 36,19.3 35.6,19.7 U11.P$13
  Bottom 0.15: v36.2,19.2 37.1,18.3 v37.1,17.3
SCL  (via drill 0.2 pad 0.13)
  Top 0.15: 51.1,21.9 v51,22.1 51,21.8 v52.2,20.6 | U2.P$17 51.4,24.5 51,24.1 v51,23.3 | U11.P$14 36.65,20.45 v37.2,19.9 | U$3.2 53.29,7.8 v53.9,7.8 | v52.2,14.7 v52.2,17.9 | R2.1 v47.5,18
  Bottom 0.15: v51,23.3 v51,22.1 51,22 48.8,19.8 47.5,19.8 | v37.2,19.9 37.2,19.8 47.5,19.8 | v53.9,7.8 52.2,9.5 v52.2,14.7 | v52.2,17.9 v52.2,20.6 | v47.5,18 47.5,19.8
SDA  (via drill 0.2 pad 0.13)
  Top 0.15: U2.P$19 52.4,24.4 52.8,24 v52.8,23.3 | v52.8,22.1 53.3,21.6 53.3,20.9 v53,20.6 | U11.P$15 37.75,21.35 38,21.1 v38,20.7 | U$3.1 49.43,7.47 v49.4,7.5 | v51.4,14.7 51.9,15.2 51.9,16.7 51.4,17.2 v51.4,17.4 50.85,17.4 R3.1
  Bottom 0.15: v38,20.7 38.2,20.7 38.8,20.1 48.7,20.1 50.2,21.6 50.2,23.3 50.8,23.9 52.3,23.9 v52.8,23.3 v52.8,22.1 | v49.4,7.5 51.4,9.5 v51.4,14.7 | v51.4,17.4 51.4,17.5 51.6,17.7 51.6,20.7 52,21.1 52.6,21.1 53,20.7 v53,20.6
SDI
  Top 0.15: X1.4 61.97,23.27 61.97,22.97 61.1,22.1 61.1,21.85 58.4,19.15 47.7,19.15 46.8,20.05 38.6,20.05 34.75,16.2 15.2,16.2 13.8,17.6 13.8,26.1 14.6,26.9 U1.7 17,26.9 19.4,24.5 28.5,24.5 29.2,25.2 29.95,25.2 30.55,24.6 U11.P$2
SDO
  Top 0.15: X1.3 61.31,25.81 61,25.5 61,22.5 60.8,22.3 60.8,22 58.25,19.45 47.85,19.45 46.95,20.35 38.45,20.35 34.6,16.5 15.4,16.5 14.1,17.8 14.1,22 14.6,22.5 U1.3 18.1,22.5 19.5,23.9 30.35,23.9 30.4,23.95 U11.P$3
VCC
  Top 0.15: R12.1 38.15,12.95 38.2,13
  Top 0.3: U4.2 41.5,12.2 41.2,12.5 | R10.2 28.8,14.1 28.2,13.5 D3.C
  Top 0.6: D3.C 29.15,12.95 C17.2 C16.2 C15.2 34.55,13 38.2,13 40.7,13 41.2,12.5
XI
  Top 0.15: U12.3 30.15,21.35 30.8,22 U11.P$6
XO
  Top 0.15: U12.1 30.3,18.95 30.5,19.15 30.5,21 30.85,21.35 U11.P$7